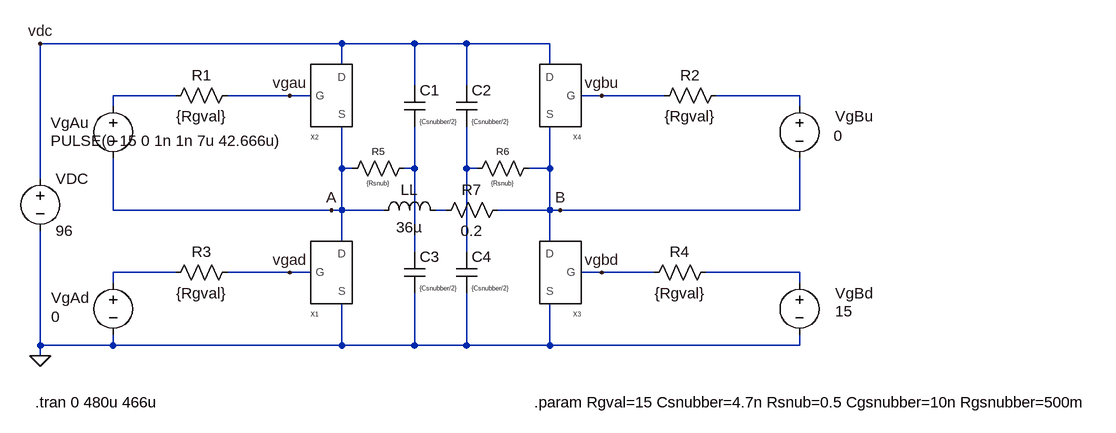
[diagram p0: schematic Circuit.asc]
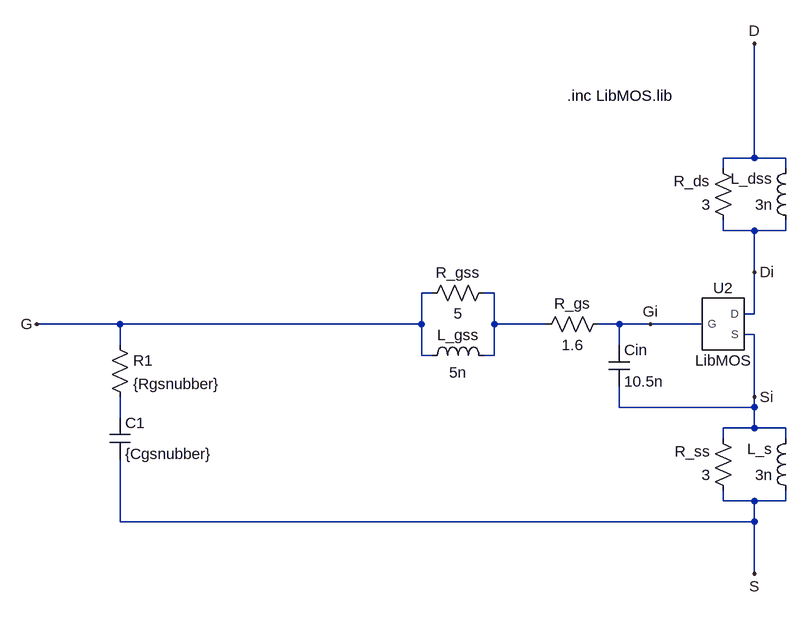
[diagram p1: sub-circuit mymos.asc]
Circuit.asc, the LTspice schematic file:
Version 4
SHEET 1 1448 680
WIRE 192 -192 -272 -192
WIRE 304 -192 192 -192
WIRE 384 -192 304 -192
WIRE 512 -192 384 -192
WIRE 192 -160 192 -192
WIRE 512 -160 512 -192
WIRE 304 -128 304 -192
WIRE 384 -128 384 -192
WIRE -64 -112 -160 -112
WIRE 112 -112 16 -112
WIRE 144 -112 112 -112
WIRE 592 -112 560 -112
WIRE 688 -112 592 -112
WIRE 896 -112 768 -112
WIRE -160 -96 -160 -112
WIRE 896 -96 896 -112
WIRE 192 0 192 -64
WIRE 208 0 192 0
WIRE 304 0 304 -64
WIRE 304 0 288 0
WIRE 384 0 384 -64
WIRE 400 0 384 0
WIRE 512 0 512 -64
WIRE 512 0 480 0
WIRE -272 16 -272 -192
WIRE -160 64 -160 -16
WIRE 176 64 -160 64
WIRE 192 64 192 0
WIRE 192 64 176 64
WIRE 256 64 192 64
WIRE 352 64 336 64
WIRE 512 64 512 0
WIRE 512 64 432 64
WIRE 528 64 512 64
WIRE 896 64 896 -16
WIRE 896 64 528 64
WIRE 192 112 192 64
WIRE 512 112 512 64
WIRE 304 128 304 0
WIRE 384 128 384 0
WIRE -64 160 -160 160
WIRE 112 160 16 160
WIRE 144 160 112 160
WIRE 592 160 560 160
WIRE 672 160 592 160
WIRE 896 160 752 160
WIRE -160 176 -160 160
WIRE 896 176 896 160
WIRE -272 272 -272 96
WIRE -160 272 -160 256
WIRE -160 272 -272 272
WIRE 192 272 192 208
WIRE 192 272 -160 272
WIRE 304 272 304 192
WIRE 304 272 192 272
WIRE 384 272 384 192
WIRE 384 272 304 272
WIRE 512 272 512 208
WIRE 512 272 384 272
WIRE 896 272 896 256
WIRE 896 272 512 272
WIRE -272 288 -272 272
FLAG -272 288 0
FLAG 176 64 A
FLAG 528 64 B
FLAG 112 -112 vgau
FLAG 112 160 vgad
FLAG 592 -112 vgbu
FLAG 592 160 vgbd
FLAG -272 -192 vdc
SYMBOL MyMOS 192 160 R0
SYMATTR InstName X1
SYMBOL MyMOS 192 -112 R0
SYMATTR InstName X2
SYMBOL MyMOS 512 160 M0
SYMATTR InstName X3
SYMBOL voltage -272 0 R0
WINDOW 123 0 0 Left 0
WINDOW 39 0 0 Left 0
SYMATTR InstName VDC
SYMATTR Value 96
SYMBOL MyMOS 512 -112 M0
SYMATTR InstName X4
SYMBOL ind 240 80 R270
WINDOW 0 32 56 VTop 2
WINDOW 3 5 56 VBottom 2
SYMATTR InstName LL
SYMATTR Value 36µ
SYMBOL voltage -160 -112 R0
WINDOW 0 -96 42 Left 2
WINDOW 3 -96 69 Left 2
WINDOW 123 0 0 Left 0
WINDOW 39 0 0 Left 0
SYMATTR InstName VgAu
SYMATTR Value PULSE(0 15 0 1n 1n 7u 42.666u)
SYMBOL voltage -160 160 R0
WINDOW 0 -95 39 Left 2
WINDOW 3 -95 68 Left 2
WINDOW 123 0 0 Left 0
WINDOW 39 0 0 Left 0
SYMATTR InstName VgAd
SYMATTR Value 0
SYMBOL voltage 896 -112 R0
WINDOW 0 55 32 Left 2
WINDOW 3 53 62 Left 2
WINDOW 123 0 0 Left 0
WINDOW 39 0 0 Left 0
SYMATTR InstName VgBu
SYMATTR Value 0
SYMBOL voltage 896 160 R0
WINDOW 0 55 32 Left 2
WINDOW 3 55 60 Left 2
WINDOW 123 0 0 Left 0
WINDOW 39 0 0 Left 0
SYMATTR InstName VgBd
SYMATTR Value 15
SYMBOL res 32 -128 R90
WINDOW 0 0 56 VBottom 2
WINDOW 3 32 56 VTop 2
SYMATTR InstName R1
SYMATTR Value {Rgval}
SYMBOL res 784 -128 R90
WINDOW 0 0 56 VBottom 2
WINDOW 3 32 56 VTop 2
SYMATTR InstName R2
SYMATTR Value {Rgval}
SYMBOL res 32 144 R90
WINDOW 0 0 56 VBottom 2
WINDOW 3 32 56 VTop 2
SYMATTR InstName R3
SYMATTR Value {Rgval}
SYMBOL res 768 144 R90
WINDOW 0 0 56 VBottom 2
WINDOW 3 32 56 VTop 2
SYMATTR InstName R4
SYMATTR Value {Rgval}
SYMBOL res 448 48 R90
WINDOW 0 0 56 VBottom 2
WINDOW 3 32 56 VTop 2
SYMATTR InstName R7
SYMATTR Value 0.2
SYMBOL res 304 -16 R90
WINDOW 0 0 56 VBottom 1
WINDOW 3 32 56 VTop 0
SYMATTR InstName R5
SYMATTR Value {Rsnub}
SYMBOL cap 288 -128 R0
WINDOW 3 24 56 Left 0
SYMATTR InstName C1
SYMATTR Value {Csnubber/2}
SYMBOL cap 368 -128 R0
WINDOW 3 24 56 Left 0
SYMATTR InstName C2
SYMATTR Value {Csnubber/2}
SYMBOL cap 288 128 R0
WINDOW 3 24 56 Left 0
SYMATTR InstName C3
SYMATTR Value {Csnubber/2}
SYMBOL cap 368 128 R0
WINDOW 3 24 56 Left 0
SYMATTR InstName C4
SYMATTR Value {Csnubber/2}
SYMBOL res 496 -16 R90
WINDOW 0 0 56 VBottom 1
WINDOW 3 32 56 VTop 0
SYMATTR InstName R6
SYMATTR Value {Rsnub}
TEXT -280 360 Left 2 !.tran 0 480u 466u
TEXT 488 360 Left 2 !.param Rgval=15 Csnubber=4.7n Rsnub=0.5 Cgsnubber=10n Rgsnubber=500m

mymos.asc, the sub-circuit schematic file:
Version 4
SHEET 1 880 680
WIRE 160 -128 160 -304
WIRE 160 -128 112 -128
WIRE 208 -128 160 -128
WIRE 112 -112 112 -128
WIRE 208 -112 208 -128
WIRE 112 -16 112 -32
WIRE 160 -16 112 -16
WIRE 208 -16 208 -32
WIRE 208 -16 160 -16
WIRE 160 48 160 -16
WIRE -336 80 -352 80
WIRE -240 80 -256 80
WIRE 160 112 160 48
WIRE 160 112 144 112
WIRE -816 128 -944 128
WIRE -352 128 -352 80
WIRE -352 128 -816 128
WIRE -240 128 -240 80
WIRE -160 128 -240 128
WIRE -48 128 -80 128
WIRE 0 128 -48 128
WIRE 80 128 0 128
WIRE 160 144 144 144
WIRE -816 160 -816 128
WIRE -48 160 -48 128
WIRE -352 176 -352 128
WIRE -336 176 -352 176
WIRE -240 176 -240 128
WIRE -240 176 -256 176
WIRE 160 240 160 144
WIRE -48 256 -48 224
WIRE 160 256 160 240
WIRE 160 256 -48 256
WIRE -816 272 -816 240
WIRE 160 288 160 256
WIRE 160 288 112 288
WIRE 208 288 160 288
WIRE 112 304 112 288
WIRE 208 304 208 288
WIRE 112 400 112 384
WIRE 160 400 112 400
WIRE 208 400 208 384
WIRE 208 400 160 400
WIRE -816 432 -816 336
WIRE 160 432 160 400
WIRE 160 432 -816 432
WIRE 160 512 160 432
FLAG -944 128 G
FLAG 160 -304 D
FLAG 160 512 S
FLAG 160 48 Di
FLAG 160 240 Si
FLAG 0 128 Gi
SYMBOL res -240 64 R90
WINDOW 0 0 56 VBottom 2
WINDOW 3 32 56 VTop 2
SYMATTR InstName R_gss
SYMATTR Value 5
SYMBOL res 128 -16 R180
WINDOW 0 36 76 Left 2
WINDOW 3 36 40 Left 2
SYMATTR InstName R_ds
SYMATTR Value 3
SYMBOL res 128 400 R180
WINDOW 0 36 76 Left 2
WINDOW 3 36 40 Left 2
SYMATTR InstName R_ss
SYMATTR Value 3
SYMBOL ind -352 192 R270
WINDOW 0 32 56 VTop 2
WINDOW 3 5 56 VBottom 2
SYMATTR InstName L_gss
SYMATTR Value 5n
SYMBOL ind 224 -16 R180
WINDOW 0 36 80 Left 2
WINDOW 3 36 40 Left 2
SYMATTR InstName L_dss
SYMATTR Value 3n
SYMBOL ind 224 400 R180
WINDOW 0 36 80 Left 2
WINDOW 3 36 40 Left 2
SYMATTR InstName L_s
SYMATTR Value 3n
SYMBOL res -64 112 R90
WINDOW 0 0 56 VBottom 2
WINDOW 3 32 56 VTop 2
SYMATTR InstName R_gs
SYMATTR Value 1.6
SYMBOL cap -64 160 R0
SYMATTR InstName Cin
SYMATTR Value 10.5n
SYMBOL LibMOS 112 128 R0
SYMATTR InstName U2
SYMATTR Value LibMOS
SYMBOL cap -832 272 R0
SYMATTR InstName C1
SYMATTR Value {Cgsnubber}
SYMBOL res -832 144 R0
SYMATTR InstName R1
SYMATTR Value {Rgsnubber}
TEXT -128 -224 Left 2 !.inc LibMOS.lib

The netlist it stands for:
* Circuit.asc
XX1 vgad A 0 mymos
XX2 vgau vdc A mymos
XX3 vgbd B 0 mymos
VDC vdc 0 96
XX4 vgbu vdc B mymos
LL A N005 36µ
VgAu N001 A PULSE(0 15 0 1n 1n 7u 42.666u)
VgAd N006 0 0
VgBu N002 B 0
VgBd N007 0 15
R1 vgau N001 {Rgval}
R2 N002 vgbu {Rgval}
R3 vgad N006 {Rgval}
R4 N007 vgbd {Rgval}
R7 B N005 0.2
R5 N003 A {Rsnub}
C1 vdc N003 {Csnubber/2}
C2 vdc N004 {Csnubber/2}
C3 N003 0 {Csnubber/2}
C4 N004 0 {Csnubber/2}
R6 B N004 {Rsnub}

* block symbol definitions
.subckt mymos G D S
R_gss N001 G 5
R_ds Di D 3
R_ss S Si 3
L_gss G N001 5n
L_dss Di D 3n
L_s S Si 3n
R_gs Gi N001 1.6
Cin Gi Si 10.5n
XU2 Gi Di Si LibMOS  ; pins G D S
C1 N002 S {Cgsnubber}
R1 G N002 {Rgsnubber}
.inc LibMOS.lib
.ends mymos

.tran 0 480u 466u
.param Rgval=15 Csnubber=4.7n Rsnub=0.5 Cgsnubber=10n Rgsnubber=500m
.lib LibMOS.lib
.backanno
.end